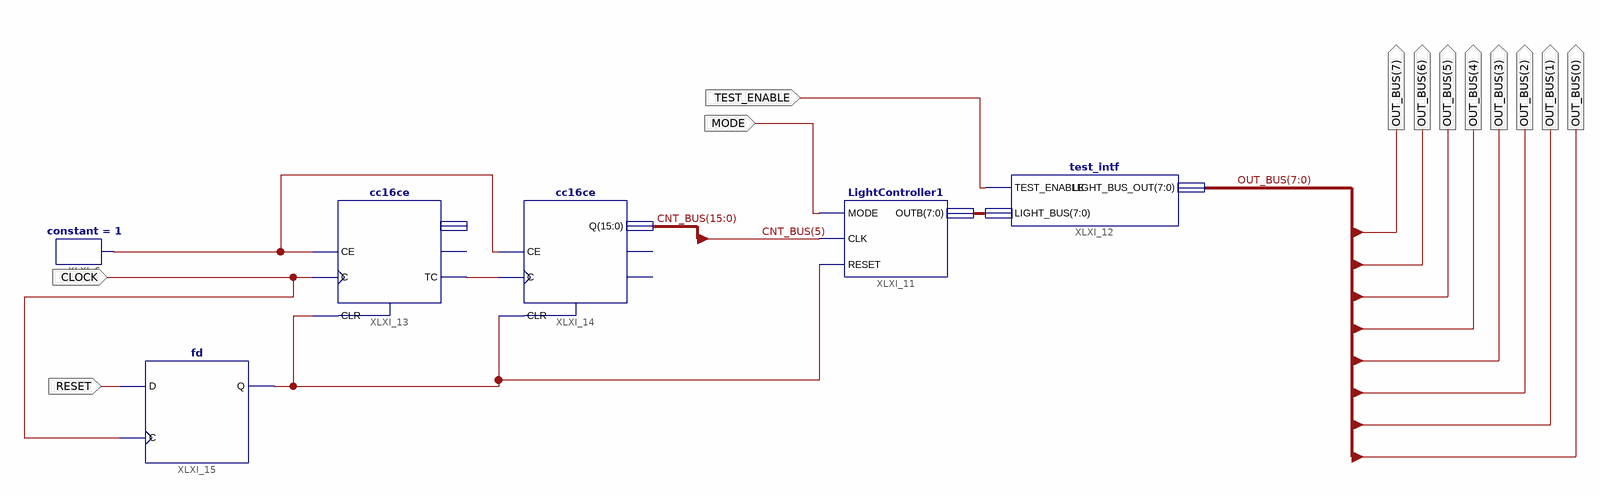
[diagram p0: schematic sheet 1]
// Xilinx ISE schematic TopLevel.sch (spartan3a) as structural Verilog: 6 symbols, 12 ports
module TopLevel (
  input  MODE,
  input  TEST_ENABLE,
  input  CLOCK,
  input  RESET,
  output [7:0] OUT_BUS
);

  wire CLOCK1, XLXN_5, XLXN_12;
  wire [7:0] XLXN_15;
  wire [15:0] CNT_BUS;

  constant #(.CValue("1")) XLXI_6 (.O(XLXN_12));
  LightController1 XLXI_11 (.MODE(MODE), .CLK(CNT_BUS[5]), .RESET(XLXN_5), .OUTB(XLXN_15));
  test_intf XLXI_12 (.TEST_ENABLE(TEST_ENABLE), .LIGHT_BUS(XLXN_15), .LIGHT_BUS_OUT(OUT_BUS));
  cc16ce XLXI_13 (.C(CLOCK), .CE(XLXN_12), .CLR(XLXN_5), .TC(CLOCK1));  // open: CEO, Q
  cc16ce XLXI_14 (.C(CLOCK1), .CE(XLXN_12), .CLR(XLXN_5), .Q(CNT_BUS));  // open: CEO, TC
  fd XLXI_15 (.C(CLOCK), .D(RESET), .Q(XLXN_5));
endmodule
